# Altium schematic sheet controller_8266_switch.SchDoc
size A4; DocumentNumber: 3; SheetNumber: 3; SheetTotal: 3
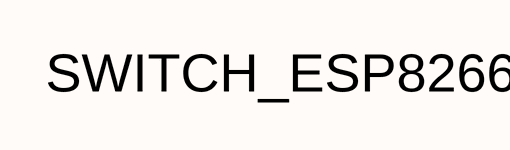
[diagram p0: controller_8266_switch.SchDoc]

## Notes on the sheet
- SWITCH_ESP8266